# EAGLE schematic Works_001 (EAGLE 8.2.1)
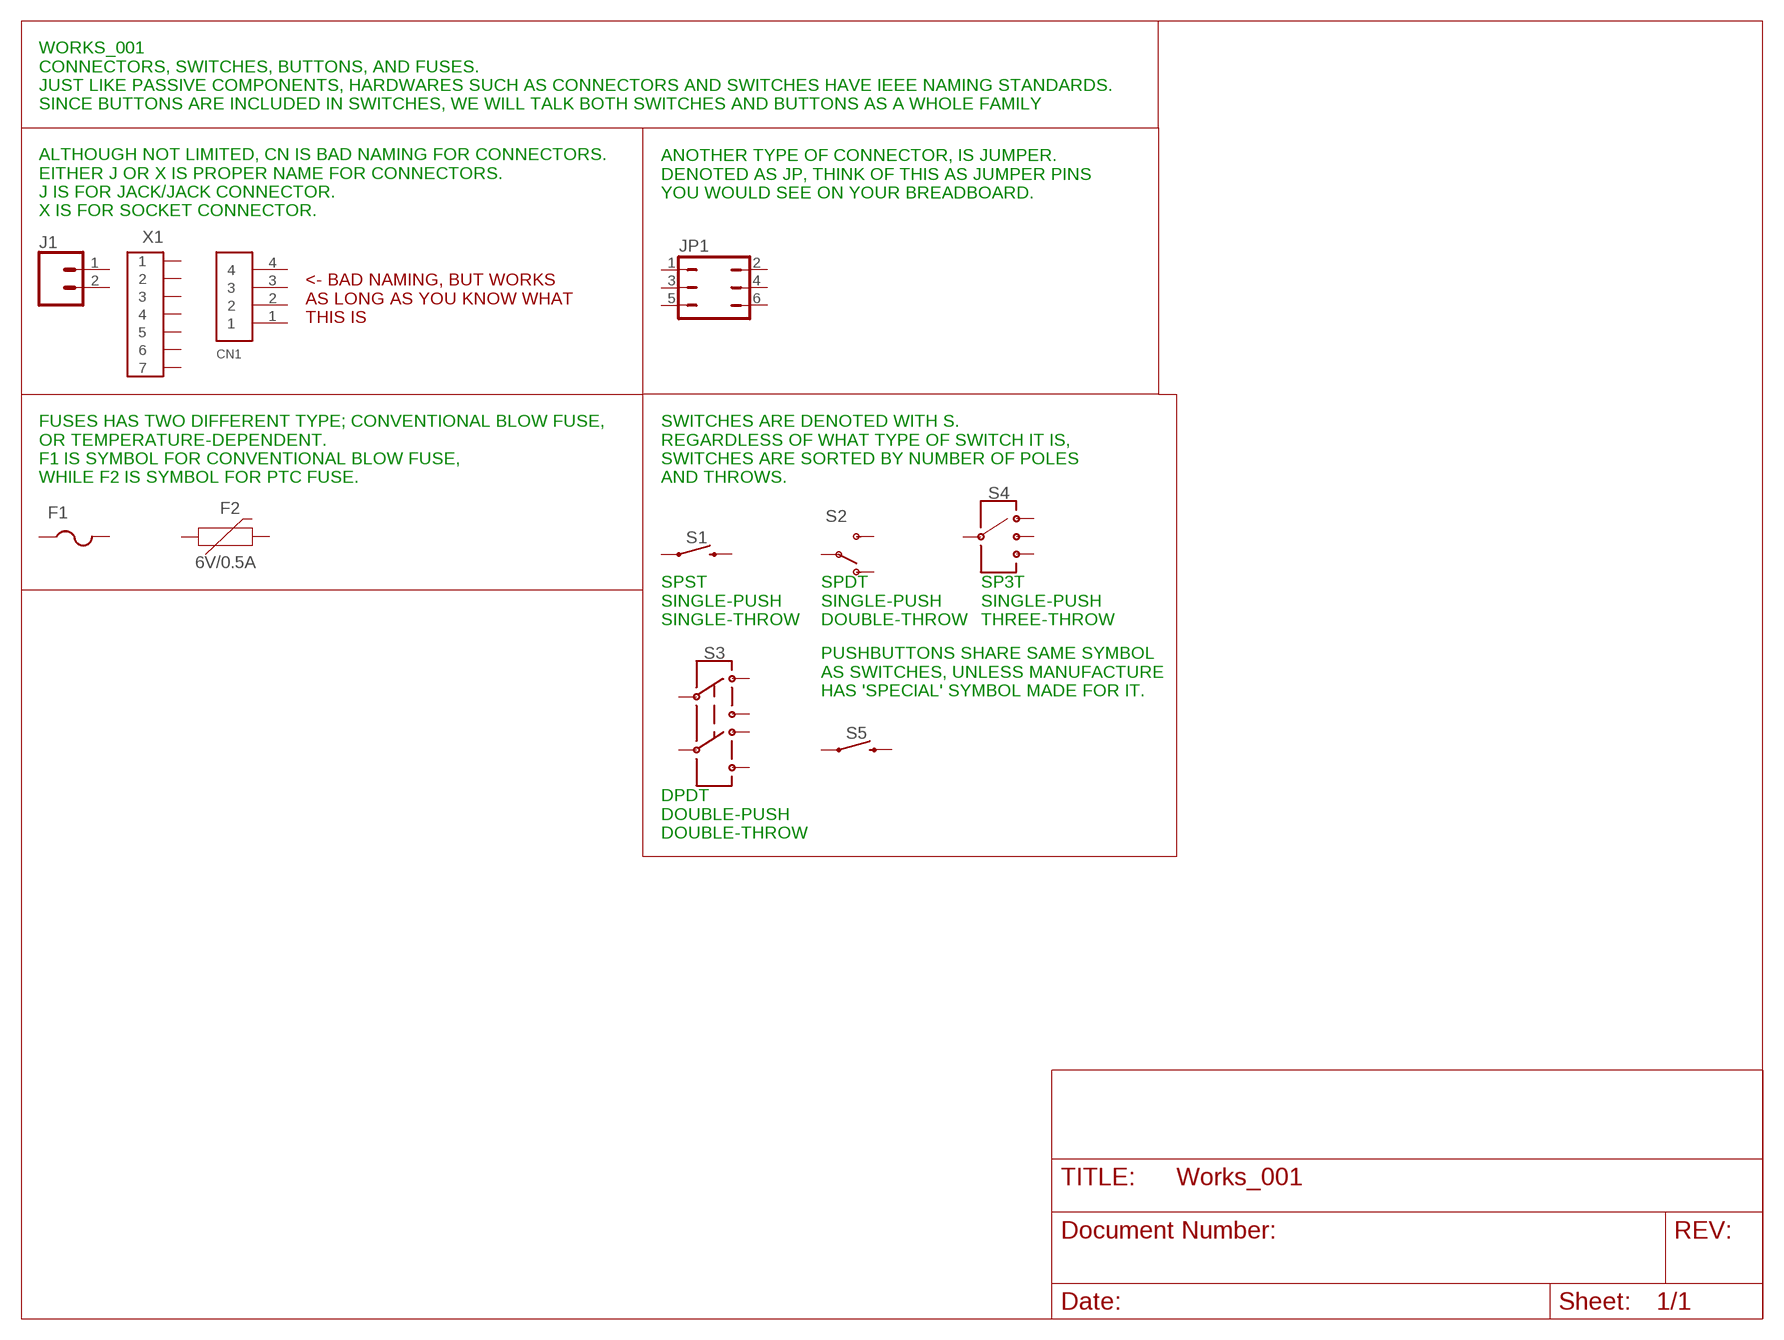
[diagram p0: schematic, sheet 1]

## Parts
CN1  1X4-CLEANBIG  [1X04-CLEANBIG]
F1  PTCFUSE-1206  [R1206]
F2  6V/0.5A  PPTC_HALF-AMP  [1206]
J1  CONN_02-JST-2MM-SMT  [JST-2-SMD]
JP1  JP3Q  [JP3Q]
S1  MOMENTARY-SWITCH-SPST-PTH-6.0MM  [TACTILE_SWITCH_PTH_6.0MM]
S2  SWITCH_SPDT  [KPS-1290]
S3  SWITCH-DPDT-PTH-GPI-152-3013  [SWITCH_DPDT_PTH_GPI-152-3013]
S4  SWITCH-SP3T-SMD  [SWITCH_SP3T_SMD]
S5  MOMENTARY-SWITCH-SPST-PTH-6.0MM  [TACTILE_SWITCH_PTH_6.0MM]
X1  SATA7-32009-10X  [CCATA_32009_10X]
Unconnected: CN1.1 CN1.2 CN1.3 CN1.4 F1.1 F1.2 F2.1 F2.2 J1.1 J1.2 JP1.1 JP1.2 JP1.3 JP1.4 JP1.5 JP1.6 S1.1 S1.3 S2.O S2.P S2.S S3.10 S3.11 S3.20 S3.21 S3.C@1 S3.C@2 S4.1 S4.2 S4.3 S4.4 S5.1 S5.3 X1.1 X1.2 X1.3 X1.4 X1.5 X1.6 X1.7

## Notes on the sheet
- WORKS_001
  CONNECTORS, SWITCHES, BUTTONS, AND FUSES.
  JUST LIKE PASSIVE COMPONENTS, HARDWARES SUCH AS CONNECTORS AND SWITCHES HAVE IEEE NAMING STANDARDS.
  SINCE BUTTONS ARE INCLUDED IN SWITCHES, WE WILL TALK BOTH SWITCHES AND BUTTONS AS A WHOLE FAMILY
- ANOTHER TYPE OF CONNECTOR, IS JUMPER.
  DENOTED AS JP, THINK OF THIS AS JUMPER PINS 
  YOU WOULD SEE ON YOUR BREADBOARD.
- ALTHOUGH NOT LIMITED, CN IS BAD NAMING FOR CONNECTORS.
  EITHER J OR X IS PROPER NAME FOR CONNECTORS.
  J IS FOR JACK/JACK CONNECTOR.
  X IS FOR SOCKET CONNECTOR.
- <- BAD NAMING, BUT WORKS
  AS LONG AS YOU KNOW WHAT
  THIS IS
- FUSES HAS TWO DIFFERENT TYPE; CONVENTIONAL BLOW FUSE,
  OR TEMPERATURE-DEPENDENT.
  F1 IS SYMBOL FOR CONVENTIONAL BLOW FUSE,
  WHILE F2 IS SYMBOL FOR PTC FUSE.
- SWITCHES ARE DENOTED WITH S.
  REGARDLESS OF WHAT TYPE OF SWITCH IT IS,
  SWITCHES ARE SORTED BY NUMBER OF POLES
  AND THROWS.
- SPST
  SINGLE-PUSH
  SINGLE-THROW
- SPDT
  SINGLE-PUSH
  DOUBLE-THROW
- SP3T
  SINGLE-PUSH
  THREE-THROW
- PUSHBUTTONS SHARE SAME SYMBOL
  AS SWITCHES, UNLESS MANUFACTURE
  HAS 'SPECIAL' SYMBOL MADE FOR IT.
- DPDT
  DOUBLE-PUSH
  DOUBLE-THROW

## Library data of the parts
CN1 = adafruit:1X4: 4-pin connector
F1 = adafruit:PTCFUSE: PTC fuses, resettable thermistors
F2 = SparkFun-Fuses:PPTC: Resettable Fuse PPTC Resettable Fuse. Really a sort of resistor with a polymeric positive temperature coefficient whose resistance increases dramatically with an increase in temperature. When heated by the power passing through the resistance rises causing the current to be limited, protecting the circuit. This is achieved by the transition of the polymer from a crystalline to an amorphous state where the conductive carbon separates breaking the conductive pathways found in the cool crystalline structure. When a PPTC cools back down it resumes conducting letting the circuit turn back on. SparkFun Products: SparkFun RedBoard - Programmed with Arduino <https://www.sparkfun.com/products/12757> Pro Micro - 5V/16MHz <https://www.sparkfun.com/products/12640> Arduino Pro 328 - 5V/16MHz <https://www.sparkfun.com/products/10915> MP3 Trigger <https://www.sparkfun.com/products/13720>; PROD_ID: RES-08585
J1 = SparkFun-Connectors:CONN_02: Multi connection point. Often used as Generic Header-pin footprint for 0.1 inch spaced/style header connections On any of the 0.1 inch spaced packages, you can populate with these: Break Away Headers - Straight <https://www.sparkfun.com/products/116> (PRT-00116) Break Away Male Headers - Right Angle <https://www.sparkfun.com/products/553> (PRT-00553) Female Headers <https://www.sparkfun.com/products/115> (PRT-00115) Break Away Headers - Machine Pin <https://www.sparkfun.com/products/117> (PRT-00117) Break Away Female Headers - Swiss Machine Pin <https://www.sparkfun.com/products/743> (PRT-00743) For SCREWTERMINALS and SPRING TERMINALS visit here: Screw Terimnals on SparkFun.com <https://www.sparkfun.com/search/results?term=Screw+Terminals> (5mm/3.5mm/2.54mm spacing) This device is also useful as a general connection point to wire up your design to another part of your project. Our various solder wires solder well into these plated through hole pads. Hook-Up Wire - Assortment (Stranded, 22 AWG) <https://www.sparkfun.com/products/11375> (PRT-11375) Hook-Up Wire - Assortment (Solid Core, 22 AWG) <https://www.sparkfun.com/products/11367> (PRT-11367) View the entire wire category on our website here <https://www.sparkfun.com/categories/141> Special notes: Molex polarized connector foot print use with: PRT-08233 with associated crimp pins and housings. 2.54_SCREWTERM for use with PRT-10571. 3.5mm Screw Terminal footprints for PRT-08084 5mm Screw Terminal footprints for use with PRT-08432; PROD_ID: CONN-11443
JP1 = jumper:JP3Q: JUMPER
S1 S5 = SparkFun-Switches:MOMENTARY-SWITCH-SPST: Momentary Switch (Pushbutton) - SPST Normally-open (NO) SPST momentary switches (buttons, pushbuttons). Variants PTH-12MM - 12mm square, through-hole Momentary Pushbutton Switch - 12mm Square <https://www.sparkfun.com/products/9190> (COM-09190) PTH-6.0MM, PTH-6.0MM-KIT - 6.0mm square, through-hole Mini Pushbutton Switch <https://www.sparkfun.com/products/97> (COM-00097) KIT package intended for soldering kit's - only one side of pads' copper is exposed. PTH-RIGHT-ANGLE-KIT - Right-angle, through-hole Right Angle Tactile Button <https://www.sparkfun.com/products/10791> - Used on SparkFun BigTime Watch Kit <https://www.sparkfun.com/products/11734> SMD-12MM - 12mm square, surface-mount Tactile Button - SMD (12mm) <https://www.sparkfun.com/products/12993> (COM-12993) Used on SparkFun PicoBoard <https://www.sparkfun.com/products/11888> SMD-4.5MM - 4.5mm Square Trackball Switch Used on SparkFun Blackberry Trackballer Breakout <https://www.sparkfun.com/products/13169> SMD-4.6MMX2.8MM - 4.60mm x 2.80mm, surface mount Used on SparkFun SAMD21 Mini Breakout <https://www.sparkfun.com/products/13664> SMD-5.2MM, SMD-5.2-REDUNDANT - 5.2mm square, surface-mount Mini Pushbutton Switch - SMD <https://www.sparkfun.com/products/8720> (COM-08720) Used on Arduino Pro Mini <https://www.sparkfun.com/products/11114> REDUNDANT package connects both switch circuits together SMD-6.0X3.5MM - 6.0 x 3.5mm, surface mount Momentary Reset Switch SMD <https://www.sparkfun.com/products/8229> (COM-08229) SMD-6.2MM-TALL - 6.2mm square, surface mount Tactile Button - SMD (6mm) <https://www.sparkfun.com/products/12992> Used on SparkFun Digital Sandbox <https://www.sparkfun.com/products/12651> SMD-RIGHT-ANGLE - Right-angle, surface mount Used on SparkFun Block for Intel® Edison - Arduino <https://www.sparkfun.com/products/13036>; PROD_ID: SWCH-08441; SF_SKU: COM-00097
S2 = SparkFun-Retired:SWITCH_SPDT: SWCH-10651 Side-actuated SPDT slide switch, as used on the Arduino Pro; PROD_ID: SWCH-10651
S3 = SparkFun-Switches:SWITCH-DPDT: Double-Pole, Double-Throw (DPDT) Switch Double-pole, double-throw switches. Variant Overview PTH-GPI-152-3013 Used on SparkFun Geiger Counter <https://www.sparkfun.com/products/11345> SMD-AY0202 Surface Mount DPDT Switch <https://www.sparkfun.com/products/597> (COM-00597) Used on e.g. LilyPad Arduino USB - ATmega32U4 Board <https://www.sparkfun.com/products/12049>; PROD_ID: SWCH-10554
S4 = SparkFun-Switches:SWITCH-SP3T: Single-Pole, Triple-Throw (SP3T) Switch Single-Pole, Triple-Throw switches SparkFun Products Prototype Part; PROD_ID: SWCH-10805
X1 = con-cypressindustries:SATA7-: Serial ATA 7 Pol. Source: www.cypressindustries.com; OC_FARNELL: unknown; OC_NEWARK: unknown